# Altium schematic sheet [11] - REVISION HISTORY.SchDoc
size A4; DocumentNumber: 11; SheetNumber: 11; SheetTotal: 12
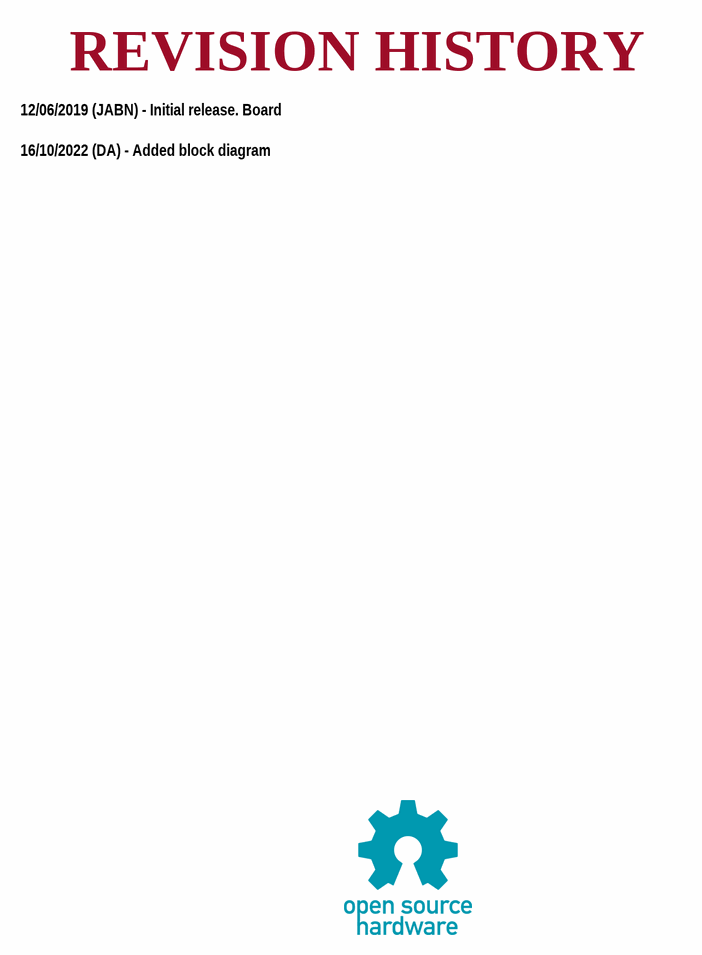
[diagram p0: [11] - REVISION HISTORY.SchDoc]

## Notes on the sheet
- 12/06/2019 (JABN) - Initial release. Board
- REVISION HISTORY
- 16/10/2022 (DA) - Added block diagram
- Project:
- Page Contents:
- Size:
- Revision:
- A4
- Document Number:
- Design:
- Date:
- Sheet
- of